# EAGLE schematic input_output (EAGLE 6.6.0)
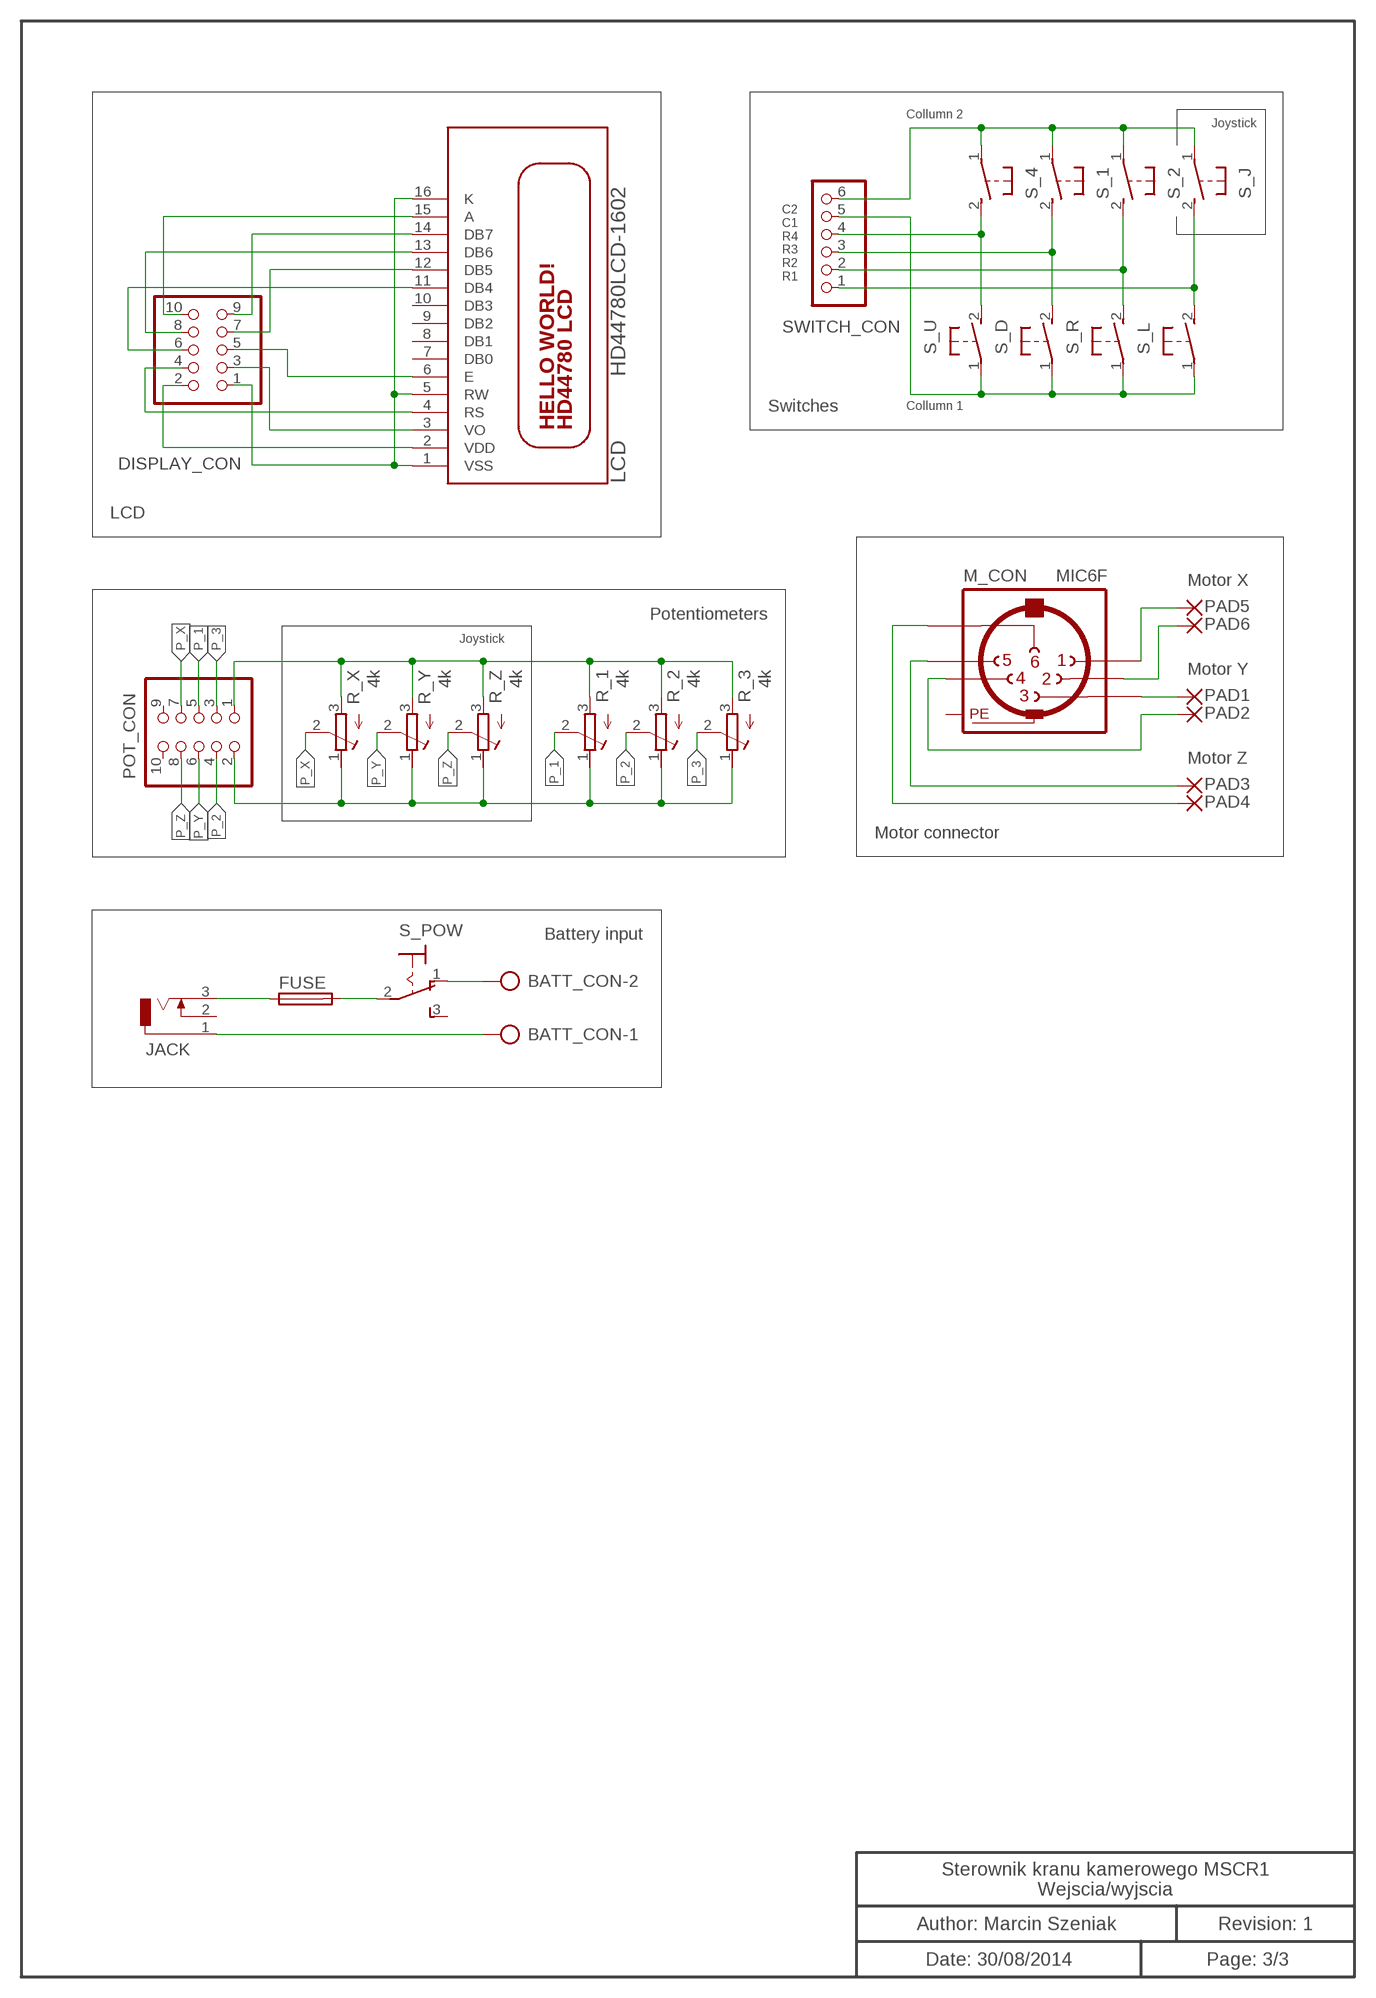
[diagram p0: schematic, sheet 1]

## Parts
BATT_CON  AK500/2-H  [AK500/2-H]
DISPLAY_CON  PINHD-2X5  [2X05]
FUSE  KS10H  [KS10H]
JACK  DCJ0303  [DCJ0303]
LCD  HD44780LCD-1602  [LCD1602]
M_CON  MIC6F  MAB6H  [MAB6H]
PAD1  2,54/1,1KLOCWIRE1  [KLOCWIRE1]
PAD2  2,54/1,1KLOCWIRE1  [KLOCWIRE1]
PAD3  2,54/1,1KLOCWIRE1  [KLOCWIRE1]
PAD4  2,54/1,1KLOCWIRE1  [KLOCWIRE1]
PAD5  2,54/1,1KLOCWIRE1  [KLOCWIRE1]
PAD6  2,54/1,1KLOCWIRE1  [KLOCWIRE1]
POT_CON  PINHD-2X5  [2X05]
R_1  4k  R-TRIMM43P  [RTRIM43P]
R_2  4k  R-TRIMM43P  [RTRIM43P]
R_3  4k  R-TRIMM43P  [RTRIM43P]
R_X  4k  R-TRIMM43P  [RTRIM43P]
R_Y  4k  R-TRIMM43P  [RTRIM43P]
R_Z  4k  R-TRIMM43P  [RTRIM43P]
S_1  31-XX  [B3F-31XX]
S_2  31-XX  [B3F-31XX]
S_4  31-XX  [B3F-31XX]
S_D  31-XX  [B3F-31XX]
S_J  31-XX  [B3F-31XX]
S_L  31-XX  [B3F-31XX]
S_POW  320-916  [320-916]
S_R  31-XX  [B3F-31XX]
S_U  31-XX  [B3F-31XX]
SWITCH_CON  PINHD-1X6  [1X06]

## Nets
N$1: DISPLAY_CON.3 LCD.3(VO)
N$2: DISPLAY_CON.9 LCD.14(DB7)
N$3: DISPLAY_CON.8 LCD.13(DB6)
N$4: DISPLAY_CON.7 LCD.12(DB5)
N$5: DISPLAY_CON.5 LCD.6(E)
N$6: DISPLAY_CON.6 LCD.11(DB4)
N$7: DISPLAY_CON.4 LCD.4(RS)
N$8: M_CON.6 PAD4.1(P)
N$9: M_CON.5 PAD3.1(P)
N$10: M_CON.4 PAD2.1(P)
N$11: M_CON.3 PAD1.1(P)
N$12: M_CON.2 PAD6.1(P)
N$13: M_CON.1 PAD5.1(P)
N$14: DISPLAY_CON.10 LCD.15(A)
N$18: POT_CON.1 R_1.3(E) R_2.3(E) R_3.3(E) R_X.3(E) R_Y.3(E) R_Z.3(E)
N$21: S_1.1(P) S_2.1(P) S_4.1(P) S_J.1(P) SWITCH_CON.6
N$22: POT_CON.2 R_1.1(A) R_2.1(A) R_3.1(A) R_X.1(A) R_Y.1(A) R_Z.1(A)
N$23: S_D.1(P) S_L.1(P) S_R.1(P) S_U.1(P) SWITCH_CON.5
N$24: S_J.2(S) S_L.2(S) SWITCH_CON.1
N$27: S_2.2(S) S_R.2(S) SWITCH_CON.2
N$29: S_1.2(S) S_D.2(S) SWITCH_CON.3
N$31: S_4.2(S) S_U.2(S) SWITCH_CON.4
N$32: FUSE.1 JACK.3
N$33: FUSE.2 S_POW.2(P)
N$34: BATT_CON.1 JACK.1
N$35: BATT_CON.2 S_POW.1(O)
P_1: POT_CON.5 R_1.2(S)
P_2: POT_CON.4 R_2.2(S)
P_3: POT_CON.3 R_3.2(S)
P_X: POT_CON.7 R_X.2(S)
P_Y: POT_CON.6 R_Y.2(S)
P_Z: POT_CON.8 R_Z.2(S)
VDD: DISPLAY_CON.2 LCD.2(VDD)
VSS: DISPLAY_CON.1 LCD.1(VSS) LCD.5(RW) LCD.16(K)
Unconnected: JACK.2 LCD.7(DB0) LCD.8(DB1) LCD.9(DB2) LCD.10(DB3) POT_CON.9 POT_CON.10 S_POW.3(S)

## Notes on the sheet
- Collumn 2
- Joystick
- C2
  C1
  R4
  R3
  R2
  R1
- Collumn 1
- Switches
- LCD
- Motor X
- Potentiometers
- Joystick
- Motor Y
- Motor Z
- Motor connector
- Battery input
- Sterownik kranu kamerowego MSCR1
  Wejscia/wyjscia
- Author: Marcin Szeniak | Revision: 1
- Date: 30/08/2014 | Page: 3/3

## Power pins joined to a net without a drawn wire
PE: M_CON.PE M_CON.PE@(PE)

## Library data of the parts
BATT_CON = con-ptr500:AK500/2-H: CONNECTOR Aug. 2004 / PTR Meßtechnik: Die Bezeichnung der Serie AK505 wurde geändert. Es handelt sich hierbei um AK500 in horizontaler Ausführung.; OC_FARNELL: unknown; OC_NEWARK: unknown
DISPLAY_CON POT_CON = pinhead:PINHD-2X5: PIN HEADER
FUSE = fuse:KS10H: FUSE HOLDER CS, Schukat; OC_FARNELL: unknown; OC_NEWARK: unknown
JACK = con-jack:DCJ0303: DC POWER JACK Source: DCJ0303.pdf; OC_FARNELL: unknown; OC_NEWARK: unknown
LCD = adafruit:HD44780LCD: HD44780 LCD Standard character type LCDs, available in sizes from 8x1 to 40x4!
M_CON = con-hirschmann:MAB6H: Female CONNECTOR 6 pins with shield, horizontal (DIN 45322); MF: FARNELL; MPN: MAB 6 H; OC_FARNELL: 809901; OC_NEWARK: 67C7887
PAD1-PAD6 = wirepad:2,54/1,1: THROUGH-HOLE PAD
R_1-R_3 R_X R_Y R_Z = resistor:R-TRIMM: Trimm resistor
S_1 S_2 S_4 S_D S_J S_L S_R S_U = switch-omron:31-XX: OMRON SWITCH; MPN: B3F-3100; OC_FARNELL: 959704; OC_NEWARK: 36M3582
S_POW = switch:320-916: TOGGLE SWITCH distributor RS Components
SWITCH_CON = pinhead:PINHD-1X6: PIN HEADER